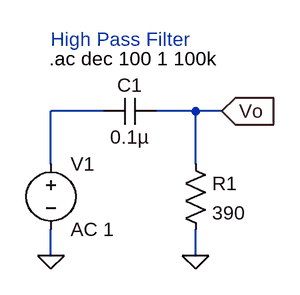
[diagram p0: schematic high_pass_filter.asc]
high_pass_filter.asc, the LTspice schematic file:
Version 4
SHEET 1 880 680
WIRE 176 96 112 96
WIRE 288 96 240 96
WIRE 320 96 288 96
WIRE 112 160 112 96
WIRE 288 160 288 96
WIRE 112 272 112 240
WIRE 288 272 288 240
FLAG 112 272 0
FLAG 288 272 0
FLAG 320 96 Vo
IOPIN 320 96 In
SYMBOL voltage 112 144 R0
WINDOW 123 0 0 Left 0
WINDOW 39 0 0 Left 0
SYMATTR InstName V1
SYMATTR Value AC 1
SYMBOL cap 240 80 R90
WINDOW 0 0 32 VBottom 2
WINDOW 3 32 32 VTop 2
SYMATTR InstName C1
SYMATTR Value 0.1µ
SYMBOL res 272 144 R0
SYMATTR InstName R1
SYMATTR Value 390
TEXT 110 32 Left 2 !.ac dec 100 1 100k
TEXT 112 8 Left 2 ;High Pass Filter

The netlist it stands for:
* high_pass_filter.asc
V1 N001 0 AC 1
C1 Vo N001 0.1µ
R1 Vo 0 390
.ac dec 100 1 100k
* High Pass Filter
.backanno
.end